# Altium schematic sheet interfaces.SchDoc
size A4; SheetNumber: 2; SheetTotal: 5
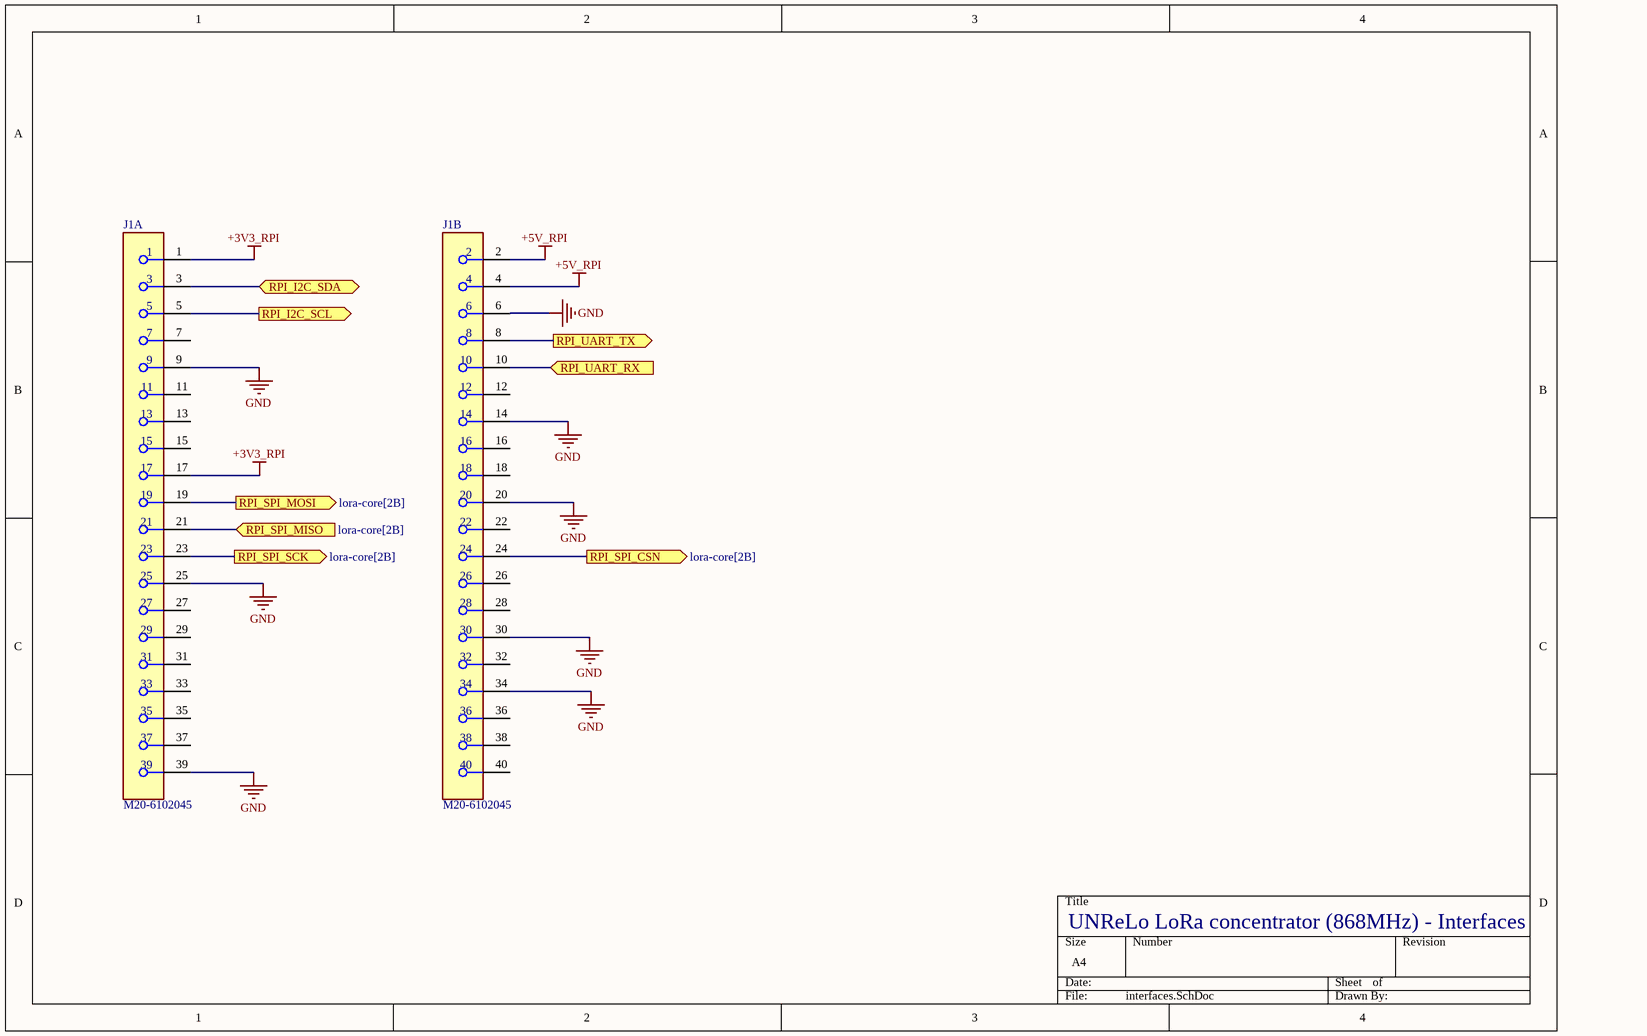
[diagram p0: interfaces.SchDoc]

## Parts
J1  M20-6102045  [FP-M20-6102045-MFG]  (parts A,B of 2)

## Ports
RPI_I2C_SCL (out), RPI_I2C_SDA (bidir), RPI_SPI_CSN (out, see lora-core[2B]), RPI_SPI_MISO (in, see lora-core[2B]), RPI_SPI_MOSI (out, see lora-core[2B]), RPI_SPI_SCK (out, see lora-core[2B]), RPI_UART_RX (in), RPI_UART_TX (out)

## Nets
+3V3_RPI: J1.1 J1.17
+5V_RPI: J1.2 J1.4
GND: J1.6 J1.9 J1.14 J1.20 J1.25 J1.30 J1.34 J1.39
RPI_I2C_SCL: J1.5 ; port RPI_I2C_SCL
RPI_I2C_SDA: J1.3 ; port RPI_I2C_SDA
RPI_SPI_CSN: J1.24 ; port RPI_SPI_CSN
RPI_SPI_MISO: J1.21 ; port RPI_SPI_MISO
RPI_SPI_MOSI: J1.19 ; port RPI_SPI_MOSI
RPI_SPI_SCK: J1.23 ; port RPI_SPI_SCK
RPI_UART_RX: J1.10 ; port RPI_UART_RX
RPI_UART_TX: J1.8 ; port RPI_UART_TX

Not connected (* = marked no-connect by the designer): J1 7 11 12 13 15 16 18 22 26 27 28 29 31 32 33 35 36 37 38 40

## Notes on the sheet
- UNReLo LoRa concentrator (868MHz) - Interfaces

## Library data of the parts
J1 = CMP-15831-000080-1: CONN STKTHRU PC/104 40POS PCB; Current Rating: 3A; Pitch: 2.54mm; Insulation Resistance: 5GR; Contact Resistance: 30mR; Number of Positions: 40; Gender: Receptacle; REACH SVHC: No SVHC; Housing Material: Nylon; Number of Rows: 2; Min Operating Temperature: -55°C; Contact Plating: Gold; Orientation: Straight; Mount: Through Hole; Contact Material: Bronze; Length: 51.46mm; Weight: 0.218205oz; Number of Contacts: 40; Packaging: Rail/Tube; Depth: 5.25mm; Termination: Solder; Radiation Hardening: No; Flammability Rating: UL94 V-0; Housing Color: Black; Max Operating Temperature: 105°C; Material: Nylon; Package Quantity: 11; Color: Black; Max Current Rating: 3A; Series: M20